# Altium schematic sheet 飞镖电源TPS54202.SchDoc
size A3; SheetNumber: 1; SheetTotal: 1
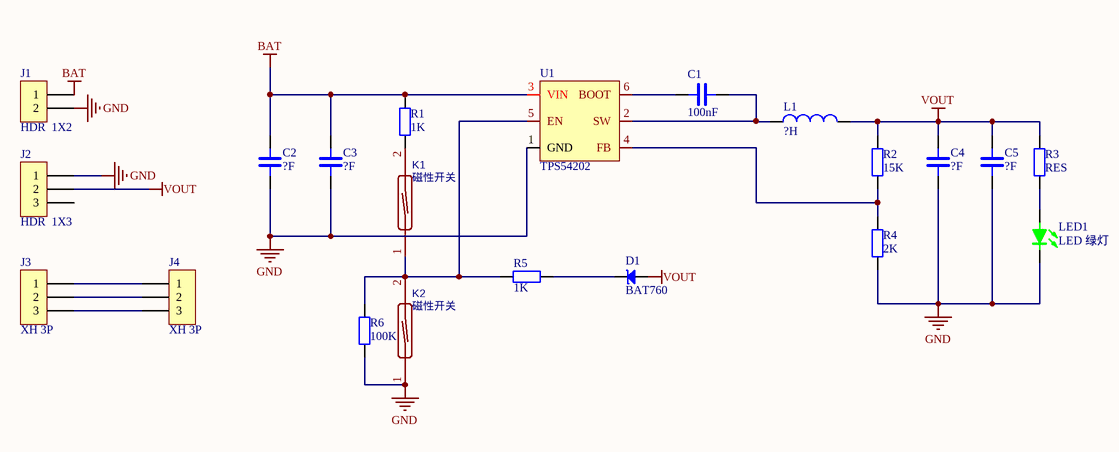
[diagram p0: 飞镖电源TPS54202.SchDoc]

## Parts
C1  100nF  [C 0603]
C2  ?F  [C 1206]
C3  ?F  [C 1206]
C4  ?F  [C 1206]
C5  ?F  [C 1206]
D1  BAT760  [SOD-323]
J1  HDR  1X2  [HDR2.54 D-L-F-1X2P]
J2  HDR  1X3  [HDR2.54 D-L-F-1X3P]
J3  XH 3P  [XH2.54-3P]
J4  XH 3P  [XH2.54-3P]
K1  磁性开关  [*MKA14103]
K2  磁性开关  [*MKA14103]
L1  ?H  [SMD 7*7*4]
LED1  LED 绿灯  [LED 0603-G]
R1  1K  [R 0603]
R2  15K  [R 0603]
R3  RES  [R 0603]
R4  2K  [R 0603]
R5  1K  [R 0603]
R6  100K  [R 0603]
U1  TPS54202  [SOT23-6]

## Nets
BAT: C2.2 C3.2 J1.1 R1.2 U1.3(VIN)
GND: C2.1 C3.1 C4.1 C5.1 J1.2 J2.1 K2.1 LED1.2(C) R4.1 R6.1 U1.1(GND)
VOUT: C4.2 C5.2 D1.1(A) J2.2 L1.2 R2.2 R3.2
NetC1_1: C1.1 U1.6(BOOT)
NetC1_2: C1.2 L1.1 U1.2(SW)
NetD1_2: D1.2(K) R5.2
NetJ3_1: J3.1 J4.1
NetJ3_2: J3.2 J4.2
NetJ3_3: J3.3 J4.3
NetK1_1: K1.1 K2.2 R5.1 R6.2 U1.5(EN)
NetK1_2: K1.2 R1.1
NetLED1_1: LED1.1(A) R3.1
NetR2_1: R2.1 R4.2 U1.4(FB)

Not connected (* = marked no-connect by the designer): J2 3

## Library data of the parts
C1-C5 = CAP: Capacitor
D1 = BAT760: 肖特基二极管
J1 = HDR  1X2: Connector
J2 = HDR  1X3: Connector
J3 J4 = XH 3P: Connector
K1 K2 = 干簧管: 开关; BOM_Manufacturer: STANDEXMEDER; BOM_Manufacturer Part: KSK-SME560-1015; Contributor: LCSC; BOM_Supplier: LCSC; BOM_Supplier Part: C575284; BOM_JLCPCB Part Class: Extended Part; spicePre: K; spiceSymbolName: KSK-SME560-1015
L1 = Inductor: Code_IEC: 1005; Published: 8-Jun-2000; LatestRevisionDate: 17-Jul-2002; LatestRevisionNote: Re-released for DXP Platform.; PackageReference: 0402-A; Publisher: Altium Limited; Code_JEITA: 0402
LED1 = LED 绿灯: LED
R1-R6 = RES: Resistor
U1 = TPS54202: DC-DC 降压芯片; BOM_Manufacturer: SHOU HAN; BOM_Manufacturer Part: MSK12C02; Contributor: LCSC; BOM_Supplier: LCSC; BOM_Supplier Part: C431540; BOM_JLCPCB Part Class: Extended Part; spicePre: S; spiceSymbolName: MSK12C02